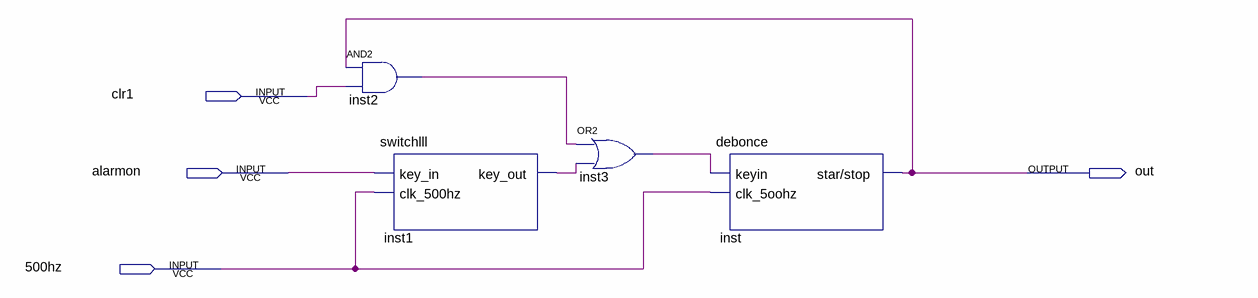
[diagram p0: schematic sheet]
// Quartus schematic alarnswitch.bdf as structural Verilog: 4 symbols, 4 pins
module alarnswitch (
  input  clr1,
  input  alarmon,
  input  \500hz ,
  output out
);

  wire inst1_key_out, inst2_out, inst3_out;

  and inst2 (inst2_out, out, clr1);
  switchlll inst1 (.key_in(alarmon), .clk_500hz(\500hz ), .key_out(inst1_key_out));
  or inst3 (inst3_out, inst2_out, inst1_key_out);
  debonce inst (.keyin(inst3_out), .clk_5oohz(\500hz ), .\star/stop (out));
endmodule
